# Altium schematic sheet IRN-back-RCA.SchDoc
size A3
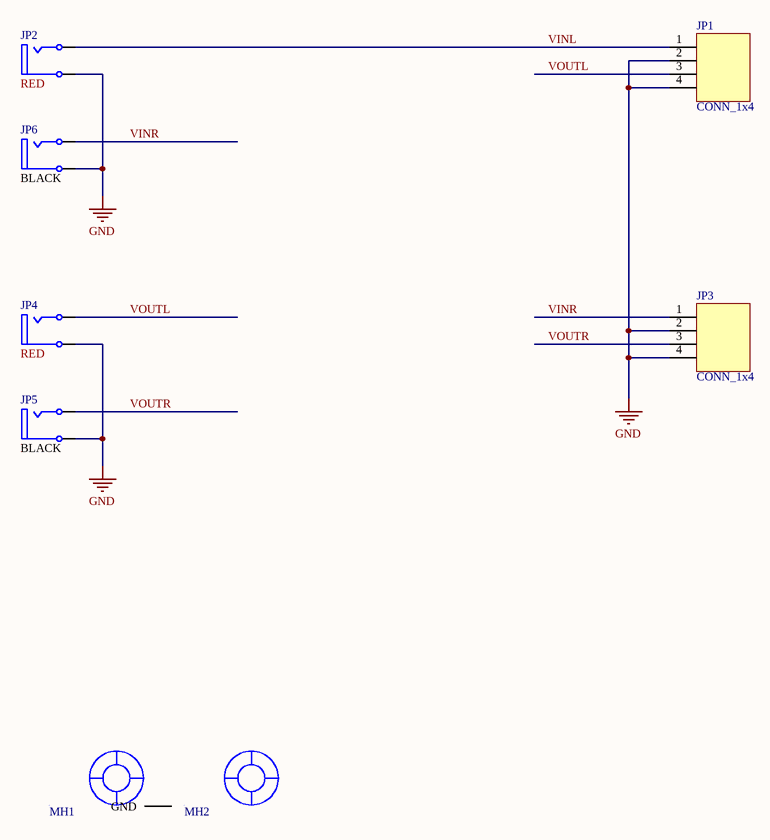
[diagram p0: IRN-back-RCA.SchDoc]

## Parts
JP1  CONN_1x4  [CONN_HDR1X4-No3D]
JP2  value RED  [CONN_RCA-Lumberg-BTOR]  (hidden comment: RCA RED)
JP3  CONN_1x4  [CONN_HDR1X4-No3D]
JP4  value RED  [CONN_RCA-Lumberg-BTOR]  (hidden comment: RCA RED)
JP5  value BLACK  [CONN_RCA-Lumberg-BTOR]  (hidden comment: RCA BLACK)
JP6  value BLACK  [CONN_RCA-Lumberg-BTOR]  (hidden comment: RCA BLACK)
MH1  Mounting hole  [MECH_MHOLE_3.5-GND]  (value not drawn)
MH2  Mounting hole  [MECH_MHOLE_3.5]  (value not drawn)

## Nets
GND: JP1.2 JP1.4 JP2.2(Ground) JP3.2 JP3.4 JP4.2(Ground) JP5.2(Ground) JP6.2(Ground)
VINL: JP1.1 JP2.1(Signal)
VINR: JP3.1 JP6.1(Signal)
VOUTL: JP1.3 JP4.1(Signal)
VOUTR: JP3.3 JP5.1(Signal)

Not connected (* = marked no-connect by the designer): MH1 0(GND)

## Library data of the parts
JP1 JP3 = CONN_MHDR_1x4: Header, 4-Pin; MPN: 0470531000; LatestRevisionDate: 17-Jul-2002; LatestRevisionNote: Re-released for DXP Platform.; Publisher: Altium Limited; DigiKey: WM4330-ND
JP2 JP4 = CONN_RCA_LUMBERG_BTOR_1_RED: RCA panel-mount socket red, 1553 02 rot, Lumberg Connect GmbH; MPN: BTOR 1 ROT; ELFA: 300-68-470; Farnell: 1368644
JP5 JP6 = CONN_RCA_LUMBERG_BTOR_1_BLACK: RCA panel-mount socket red, 1553 02 rot, Lumberg Connect GmbH; MPN: BTOR 1 SCHWARZ; ELFA: 300-68-471; Farnell: 1217030
MH1 MH2 = MECH_MHOLE